# EAGLE design vfdclock (EAGLE 7.6.0)
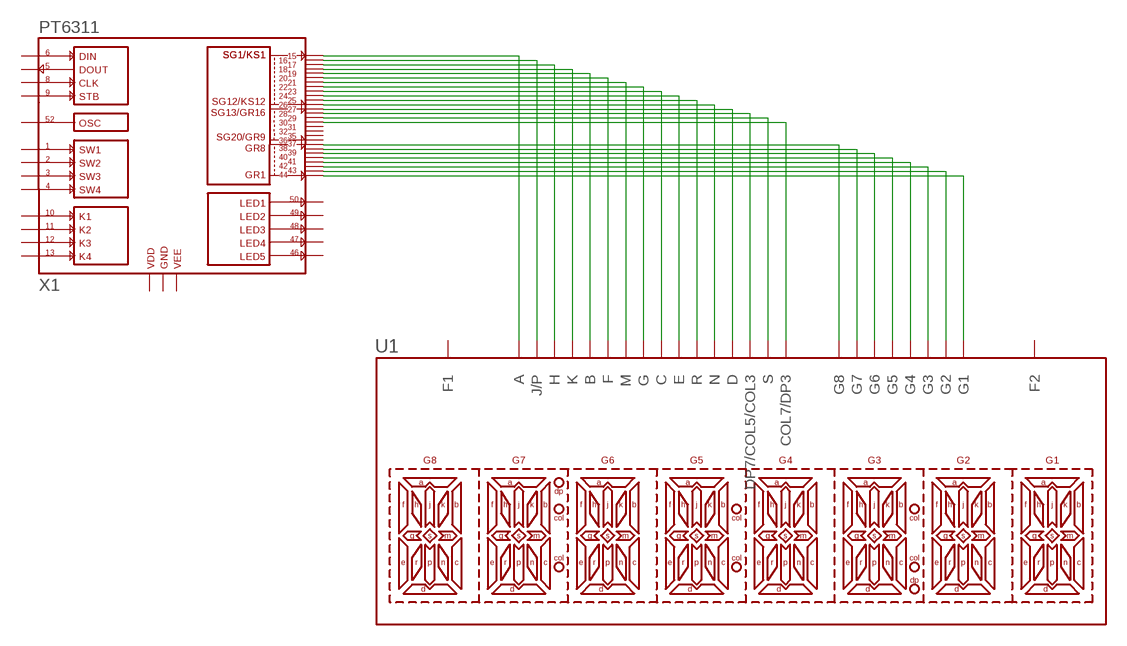
[diagram p0: schematic, sheet 1]

## Parts
U1  20070-1A04PTH  [20070-1A04]
X1  PT6311  [QFP52]

## Nets
N$1: U1.4(A) X1.P$15(SG1/KS1)
N$2: U1.5(J/P) X1.P$16(SG2/KS2)
N$3: U1.6(H) X1.P$17(SG3/KS3)
N$4: U1.7(K) X1.P$18(SG4/KS4)
N$5: U1.8(B) X1.P$19(SG5/KS5)
N$6: U1.9(F) X1.P$20(SG6/KS6)
N$7: U1.10(M) X1.P$21(SG7/KS7)
N$8: U1.11(G) X1.P$22(SG8/KS8)
N$9: U1.12(C) X1.P$23(SG9/KS9)
N$10: U1.13(E) X1.P$24(SG10/KS10)
N$11: U1.14(R) X1.P$25(SG11/KS11)
N$12: U1.15(N) X1.P$26(SG12/KS12)
N$13: U1.16(D) X1.P$27(SG13/GR16)
N$14: U1.17(DP7/COL5/COL3) X1.P$28(SG14/GR15)
N$15: U1.18(S) X1.P$29(SG15/GR14)
N$16: U1.19(COL7/DP3) X1.P$30(SG16/GR13)
N$17: U1.27(G1) X1.P$44(GR1)
N$18: U1.26(G2) X1.P$43(GR2)
N$19: U1.25(G3) X1.P$42(GR3)
N$20: U1.24(G4) X1.P$41(GR4)
N$21: U1.23(G5) X1.P$40(GR5)
N$22: U1.22(G6) X1.P$39(GR6)
N$23: U1.21(G7) X1.P$38(GR7)
N$24: U1.20(G8) X1.P$37(GR8)
Unconnected: U1.1(F1) U1.2(F1) U1.29(F2) U1.30(F2) X1.P$1(SW1) X1.P$2(SW2) X1.P$3(SW3) X1.P$4(SW4) X1.P$5(DOUT) X1.P$6(DIN) X1.P$8(CLK) X1.P$9(STB) X1.P$10(K1) X1.P$11(K2) X1.P$12(K3) X1.P$13(K4) X1.P$14(VDD) X1.P$31(SG17/GR12) X1.P$32(SG18/GR11) X1.P$33(VDD) X1.P$34(VEE) X1.P$35(SG19/GR10) X1.P$36(SG20/GR9) X1.P$45(VDD) X1.P$46(LED5) X1.P$47(LED4) X1.P$48(LED3) X1.P$49(LED2) X1.P$50(LED1) X1.P$51(GND) X1.P$52(OSC)

## Library data of the parts
U1 = VFD:20070-1A04: AOTOM 20070-1A04 Alphanumeric VFD
X1 = Drivers:PT6311: PT6311 VFD Driver PT6311 is a Vacuum Fluorescent Display (VFD) Controller driven on a 1/8 to 1/16 duty factor housed in 52-pin plastic QFP Package. Twelve segment output lines, 8 grid output lines, 8 segment/grid output drive lines, one display memory, control circuit, key scan circuit are all incorporated into a single chip to build a highly reliable peripheral device for a single chip micro computer. Serial data is fed to PT6311 via a three-line serial interface.

## Board
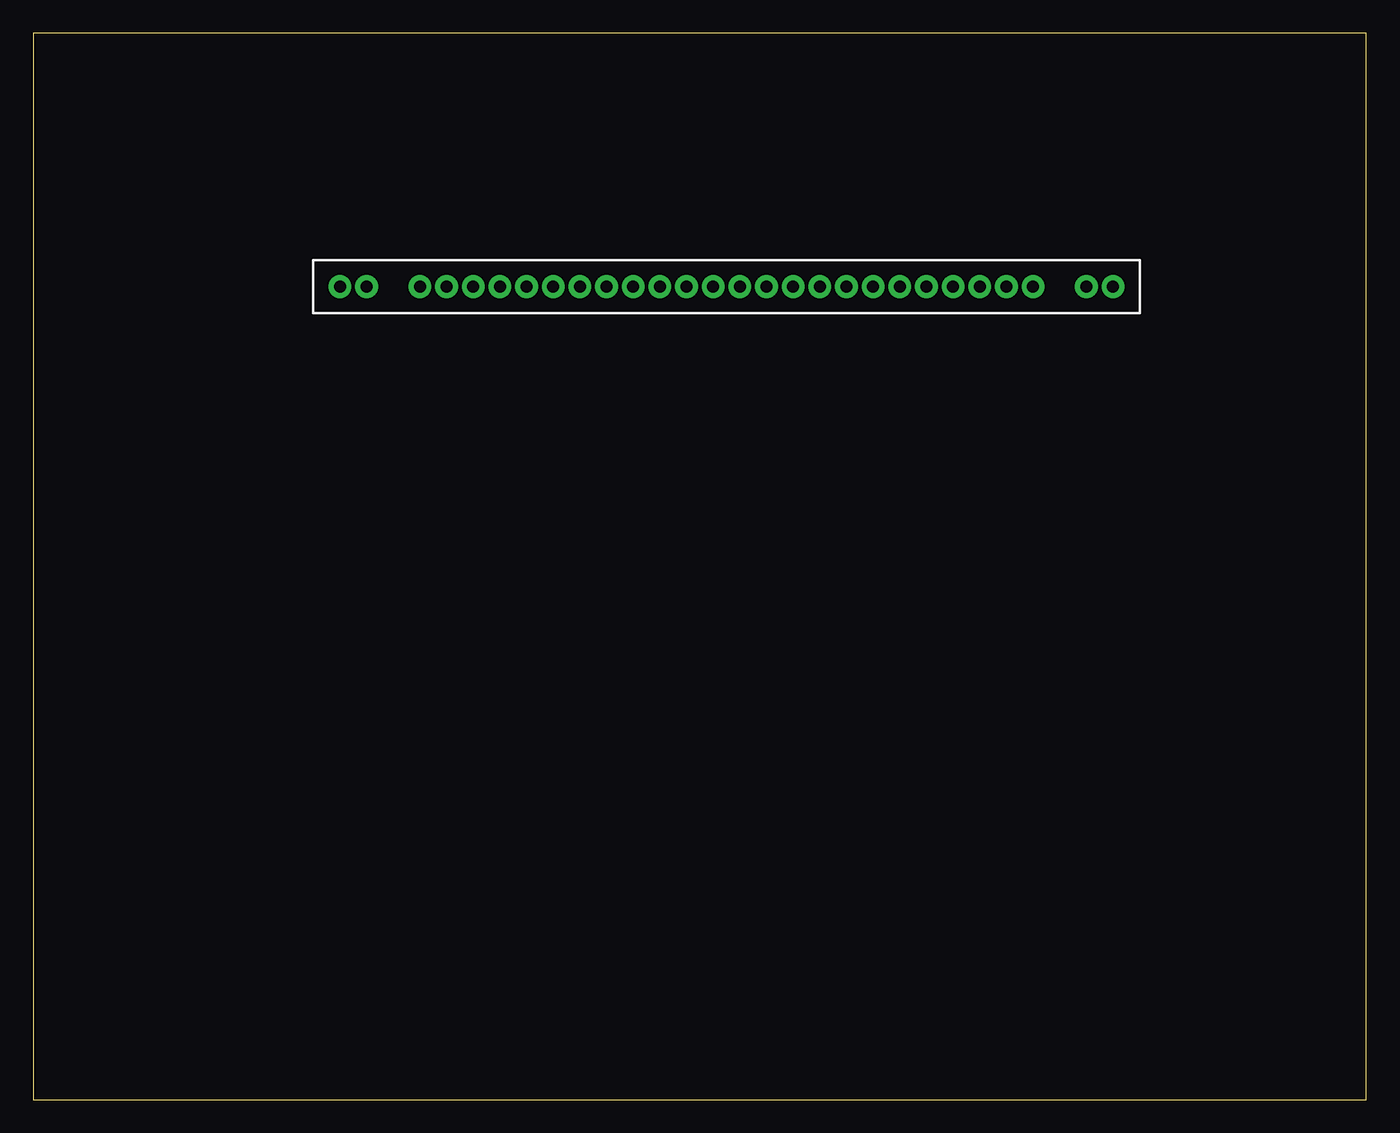
[diagram p1: board, top side]
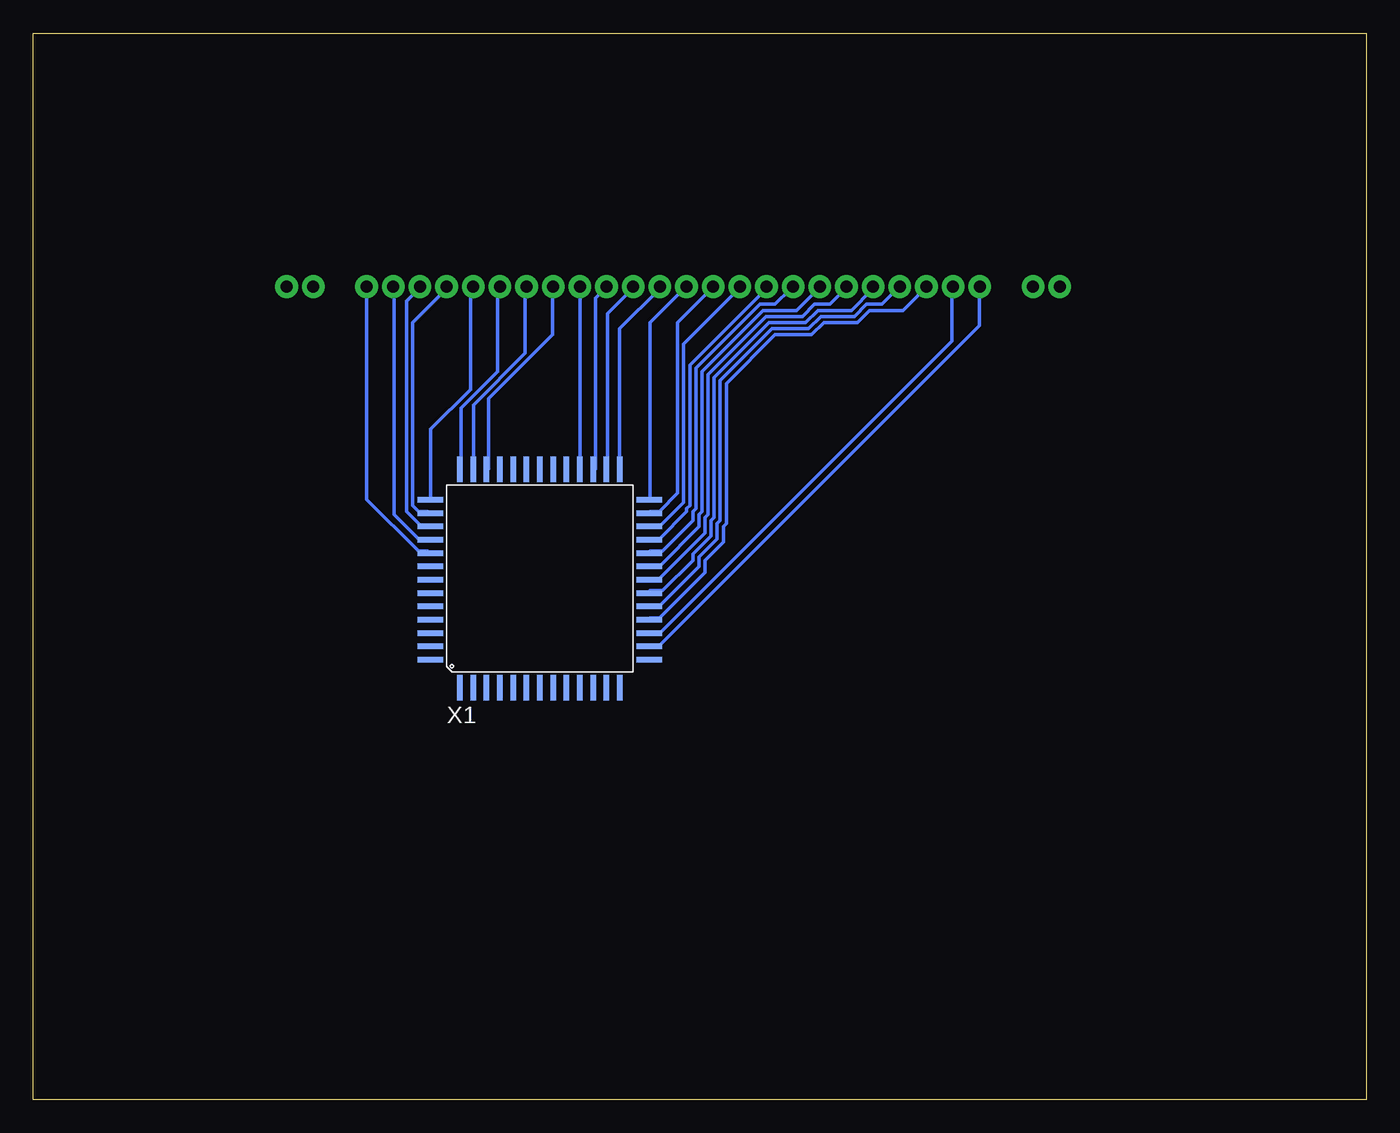
[diagram p2: board, bottom side, seen from below]

Size 100 x 80 mm. Coordinates in mm from the lower left corner, seen from the top.
Outline: 0,0 100,0 100,80 0,80 0,0
Copper layers (1*16): Top 0.035mm / dielectric 1.5mm / Bottom 0.035mm
Design rules "default": minimum track width 10mil, minimum drill 24mil, track to track 8mil, track to pad 8mil, pad to pad 8mil, via to via 8mil, smd to smd 8mil, copper to edge 40mil, drill to drill 8mil, minimum pad ring 10mil, minimum via ring 8mil, stop-mask expansion 4mil, vias tented up to drill 0mil, thermal gap 10mil

### Footprints (pad centres in the part's own frame; a part is rotated, then mirrored left to right if it is on the bottom)
20070-1A04 = drill 0.9 pad 1.7: 1 -29,0; 2 -27,0; 4 -23,0; 5 -21,0; 6 -19,0; 7 -17,0; 8 -15,0; 9 -13,0; 10 -11,0; 11 -9,0; 12 -7,0; 13 -5,0; 14 -3,0; 15 -1,0; 16 1,0; 17 3,0; 18 5,0; 19 7,0; 20 9,0; 21 11,0; 22 13,0; 23 15,0; 24 17,0; 25 19,0; 26 21,0; 27 23,0; 29 27,0; 30 29,0
QFP52 = smd 0.406 x 1.9: P$1 -6,-8.1; P$2 -5,-8.1; P$3 -4,-8.1; P$4 -3,-8.1; P$5 -2,-8.1; P$6 -1,-8.1; P$7 0,-8.1; P$8 1,-8.1; P$9 2,-8.1; P$10 3,-8.1; P$11 4,-8.1; P$12 5,-8.1; P$13 6,-8.1; P$27 6,8.3; P$28 5,8.3; P$29 4,8.3; P$30 3,8.3; P$31 2,8.3; P$32 1,8.3; P$33 0,8.3; P$34 -1,8.3; P$35 -2,8.3; P$36 -3,8.3; P$37 -4,8.3; P$38 -5,8.3; P$39 -6,8.3 | smd 1.9 x 0.406: P$14 8.2,-6; P$15 8.2,-5; P$16 8.2,-4; P$17 8.2,-3; P$18 8.2,-2; P$19 8.2,-1; P$20 8.2,0; P$21 8.2,1; P$22 8.2,2; P$23 8.2,3; P$24 8.2,4; P$25 8.2,5; P$26 8.2,6; P$40 -8.2,6; P$41 -8.2,5; P$42 -8.2,4; P$43 -8.2,3; P$44 -8.2,2; P$45 -8.2,1; P$46 -8.2,0; P$47 -8.2,-1; P$48 -8.2,-2; P$49 -8.2,-3; P$50 -8.2,-4; P$51 -8.2,-5; P$52 -8.2,-6

### Placement (x,y rotation side)
U1  52,61 0 top
X1  62,39 0 bottom

### Tracks (layer width: path | path; a pad name or v marks a point on that pad's centre or on a via)
N$1
  Bottom 0.254: X1.P$15 53.72,34.06 53.03,34.06 29.03,58.06 29.03,60.81 U1.4
N$2
  Bottom 0.254: X1.P$16 53.72,34.98 53.03,34.98 31.09,56.92 31.09,60.81 U1.5
N$3
  Bottom 0.254: X1.P$17 53.72,36.12 53.03,36.12 49.61,39.55 49.61,40.46 48.23,41.83 48.23,42.98 48.01,43.2 48.01,53.72 44.35,57.38 41.6,57.38 40.69,58.29 38.18,58.29 37.26,59.21 34.75,59.21 33.15,60.81 U1.6
N$4
  Bottom 0.254: X1.P$18 53.72,37.03 53.03,37.03 50.06,40.01 50.06,40.69 48.69,42.06 48.69,43.2 48.46,43.43 48.46,53.95 44.58,57.84 41.83,57.84 40.92,58.75 38.41,58.75 37.49,59.66 36.35,59.66 35.2,60.81 U1.7
N$5
  Bottom 0.254: X1.P$19 53.72,38.18 52.81,38.18 50.52,40.46 50.52,40.92 49.15,42.29 49.15,43.43 48.92,43.66 48.92,54.18 44.81,58.29 42.06,58.29 41.15,59.21 38.63,59.21 37.03,60.81 U1.8
N$6
  Bottom 0.254: X1.P$20 53.72,39.09 53.03,39.09 49.61,42.52 49.61,43.66 49.38,43.89 49.38,54.41 45.03,58.75 42.29,58.75 41.38,59.66 40.23,59.66 39.09,60.81 U1.9
N$7
  Bottom 0.254: X1.P$21 53.72,40.01 53.03,40.01 50.06,42.98 50.06,43.89 49.84,44.12 49.84,54.63 45.26,59.21 42.75,59.21 41.15,60.81 U1.10
N$8
  Bottom 0.254: X1.P$22 53.72,41.15 52.81,41.15 50.52,43.43 50.52,44.12 50.29,44.35 50.29,54.86 45.49,59.66 44.35,59.66 43.2,60.81 U1.11
N$9
  Bottom 0.254: X1.P$23 53.72,42.06 53.03,42.06 50.98,44.12 50.98,44.35 50.75,44.58 50.75,55.09 45.03,60.81 U1.12
N$10
  Bottom 0.254: X1.P$24 53.72,42.98 53.03,42.98 51.21,44.81 51.21,56.69 47.09,60.81 U1.13
N$11
  Bottom 0.254: X1.P$25 53.72,44.12 53.03,44.12 51.66,45.49 51.66,58.29 49.15,60.81 U1.14
N$12
  Bottom 0.254: X1.P$26 53.72,45.03 53.72,58.29 51.21,60.81 U1.15
N$13
  Bottom 0.254: X1.P$27 56.01,47.32 56.01,57.84 53.03,60.81 U1.16
N$14
  Bottom 0.254: X1.P$28 56.92,47.32 56.92,58.98 55.09,60.81 U1.17
N$15
  Bottom 0.254: X1.P$29 57.84,47.32 57.84,60.12 57.15,60.81 U1.18
N$16
  Bottom 0.254: X1.P$30 58.98,47.32 58.98,60.81 U1.19
N$17
  Bottom 0.254: X1.P$44 70.41,41.15 71.09,41.15 74.98,45.03 74.98,60.81 U1.27
N$18
  Bottom 0.254: X1.P$43 70.41,42.06 71.09,42.06 72.92,43.89 72.92,60.81 U1.26
N$19
  Bottom 0.254: X1.P$42 70.41,42.98 70.87,42.98 72.01,44.12 72.01,59.89 71.09,60.81 U1.25
N$20
  Bottom 0.254: X1.P$41 70.41,44.12 71.09,44.12 71.55,44.58 71.55,58.29 69.04,60.81 U1.24
N$21
  Bottom 0.254: X1.P$40 70.18,45.03 70.18,50.29 67.21,53.26 67.21,60.81 U1.23
N$22
  Bottom 0.254: X1.P$39 67.89,47.32 67.89,51.89 65.15,54.63 65.15,60.81 U1.22
N$23
  Bottom 0.254: X1.P$38 66.98,47.32 66.98,52.12 63.09,56.01 63.09,60.81 U1.21
N$24
  Bottom 0.254: X1.P$37 65.84,47.32 65.84,52.58 61.04,57.38 61.04,60.81 U1.20